# Altium schematic sheet Sheet1 - 修改mos管.SchDoc
size A2
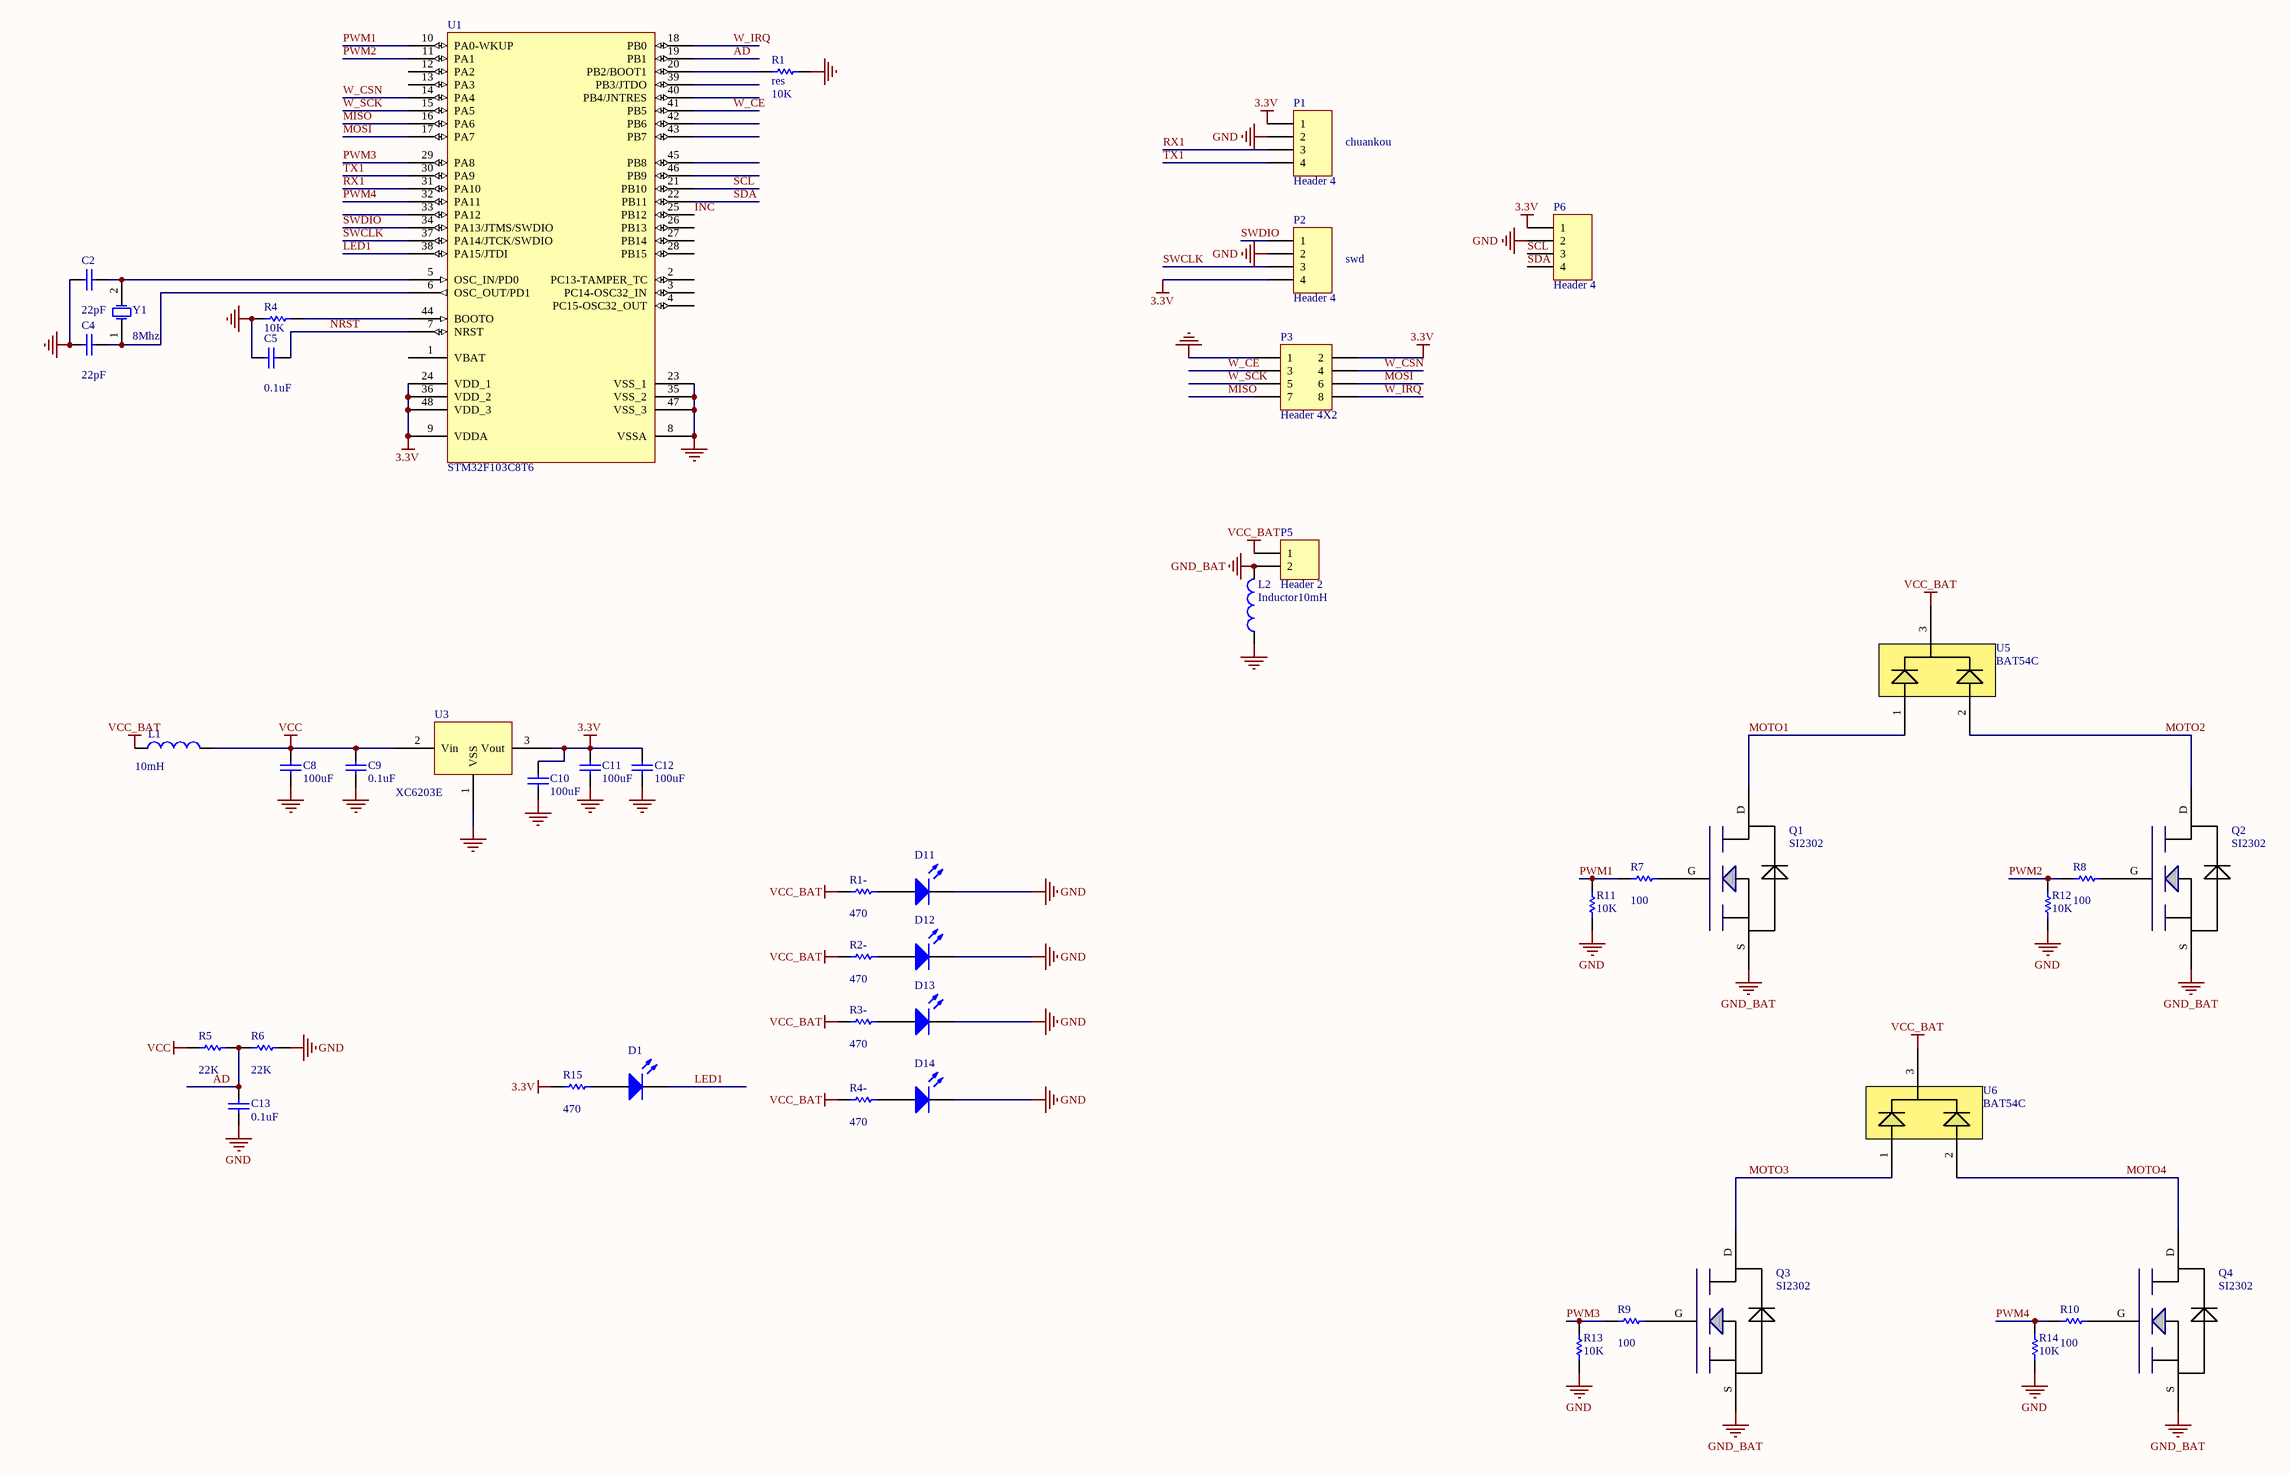
[diagram p0: Sheet1 - 修改mos管.SchDoc]

## Parts
C2  value 22pF  [0603]  (hidden comment: cap)
C4  value 22pF  [0603]  (hidden comment: cap)
C5  value 0.1uF  [0603]  (hidden comment: cap)
C8  value 100uF  [0603]  (hidden comment: cap)
C9  value 0.1uF  [0603]  (hidden comment: cap)
C10  value 100uF  [0603]  (hidden comment: cap)
C11  value 100uF  [0603]  (hidden comment: cap)
C12  value 100uF  [0603]  (hidden comment: cap)
C13  value 0.1uF  [0603]  (hidden comment: cap)
D1  LED0  [0805]  (value not drawn)
D11  LED0  [0603c]  (value not drawn)
D12  LED0  [0603c]  (value not drawn)
D13  LED0  [0603c]  (value not drawn)
D14  LED0  [0603c]  (value not drawn)
L1  value 10mH  [0805]  (hidden comment: Inductor)
L2  Inductor10mH  [0805]
P1  Header 4  [HDR1X4]
P2  Header 4  [HDR1X4]
P3  Header 4X2  [HDR2X4]
P5  Header 2  [HDR1X2]
P6  Header 4  [HDR1X4]
Q1  SI2302  [SOT-23]
Q2  SI2302  [SOT-23]
Q3  SI2302  [SOT-23]
Q4  SI2302  [SOT-23]
R1  res  res: 10K  [0603]
R1-  res: 470  [0603c]  (hidden comment: res)
R2-  res: 470  [0603c]  (hidden comment: res)
R3-  res: 470  [0603c]  (hidden comment: res)
R4  res: 10K  [0603]  (hidden comment: res)
R4-  res: 470  [0603c]  (hidden comment: res)
R5  res: 22K  [0603]  (hidden comment: res)
R6  res: 22K  [0603]  (hidden comment: res)
R7  res: 100  [0603]  (hidden comment: res)
R8  res: 100  [0603]  (hidden comment: res)
R9  res: 100  [0603]  (hidden comment: res)
R10  res: 100  [0603]  (hidden comment: res)
R11  res: 10K  [0603]  (hidden comment: res)
R12  res: 10K  [0603]  (hidden comment: res)
R13  res: 10K  [0603]  (hidden comment: res)
R14  res: 10K  [0603]  (hidden comment: res)
R15  res: 470  [0603]  (hidden comment: res)
U1  STM32F103C8T6  [LQFP48S]
U3  XC6203E  [SOT-89]
U5  BAT54C  [SOT-23]
U6  BAT54C  [SOT-23]
Y1  5032xtal  [XTAL]  (value not drawn)

## Nets
3.3V: C10.2 C11.2 C12.2 P1.1 P2.4 P3.2 P6.1 R15.1 U1.9(VDDA) U1.24(VDD_1) U1.36(VDD_2) U1.48(VDD_3) U3.3(Vout)
GND: C2.1 C4.1 C5.1 C8.1 C9.1 C10.1 C11.1 C12.1 C13.1 D11.2(K) D12.2(K) D13.2(K) D14.2(K) L2.1 P1.2 P2.2 P3.1 P6.2 R1.2 R4.1 R6.2 R11.1 R12.1 R13.1 R14.1 U1.8(VSSA) U1.23(VSS_1) U1.35(VSS_2) U1.47(VSS_3) U3.1(VSS)
GND_BAT: L2.2 P5.2 Q1.S Q2.S Q3.S Q4.S
VCC: C8.2 C9.2 L1.2 R5.1 U3.2(Vin)
VCC_BAT: L1.1 P5.1 R1-.1 R2-.1 R3-.1 R4-.1 U5.3 U6.3
AD: C13.2 R5.2 R6.1 U1.19(PB1)
INC: U1.25(PB12)
LED1: D1.2(K) U1.38(PA15/JTDI)
MISO: P3.7 U1.16(PA6)
MOSI: P3.6 U1.17(PA7)
MOTO1: Q1.D U5.1
MOTO2: Q2.D U5.2
MOTO3: Q3.D U6.1
MOTO4: Q4.D U6.2
NRST: C5.2 U1.7(NRST)
PWM1: R7.1 R11.2 U1.10(PA0-WKUP)
PWM2: R8.1 R12.2 U1.11(PA1)
PWM3: R9.1 R13.2 U1.29(PA8)
PWM4: R10.1 R14.2 U1.32(PA11)
RX1: P1.3 U1.31(PA10)
SCL: P6.3 U1.21(PB10)
SDA: P6.4 U1.22(PB11)
SWCLK: P2.3 U1.37(PA14/JTCK/SWDIO)
SWDIO: P2.1 U1.34(PA13/JTMS/SWDIO)
TX1: P1.4 U1.30(PA9)
W_CE: P3.3 U1.41(PB5)
W_CSN: P3.4 U1.14(PA4)
W_IRQ: P3.8 U1.18(PB0)
W_SCK: P3.5 U1.15(PA5)
NetC2_2: C2.2 U1.5(OSC_IN/PD0) Y1.2(OSC2)
NetC4_2: C4.2 U1.6(OSC_OUT/PD1) Y1.1(OSC1)
NetD1_1: D1.1(A) R15.2
NetD11_1: D11.1(A) R1-.2
NetD12_1: D12.1(A) R2-.2
NetD13_1: D13.1(A) R3-.2
NetD14_1: D14.1(A) R4-.2
NetQ1_G: Q1.G R7.2
NetQ2_G: Q2.G R8.2
NetQ3_G: Q3.G R9.2
NetQ4_G: Q4.G R10.2
NetR1_1: R1.1 U1.20(PB2/BOOT1)
NetR4_2: R4.2 U1.44(BOOTO)

Not connected (* = marked no-connect by the designer): U1 1(VBAT) 2(PC13-TAMPER_TC) 3(PC14-OSC32_IN) 4(PC15-OSC32_OUT) 12(PA2) 13(PA3) 26(PB13) 27(PB14) 28(PB15) 33(PA12) 39(PB3/JTDO) 40(PB4/JNTRES) 42(PB6) 43(PB7) 45(PB8) 46(PB9)

## Notes on the sheet
- chuankou
- swd
- (in symbol 5032xtal) 8Mhz

## Library data of the parts
D1 D11-D14 = LED0: Typical INFRARED GaAs LED; Published: 8-Jun-2000; LatestRevisionDate: 08-Jul-2005; LatestRevisionNote: Mech Layer 1 removed.; PackageReference: LED-0; Publisher: Altium Limited
L2 = Inductor
P1 P2 P6 = Header 4: Header, 4-Pin; LatestRevisionDate: 17-Jul-2002; LatestRevisionNote: Re-released for DXP Platform.; Publisher: Altium Limited
P3 = Header 4X2: Header, 4-Pin, Dual row; LatestRevisionDate: 17-Jul-2002; LatestRevisionNote: Re-released for DXP Platform.; Publisher: Altium Limited
P5 = Header 2: Header, 2-Pin; LatestRevisionDate: 17-Jul-2002; LatestRevisionNote: Re-released for DXP Platform.; Publisher: Altium Limited
Q1-Q4 = SI2302: pin to pad: D>3 G>1 S>2
U3 = XC6203